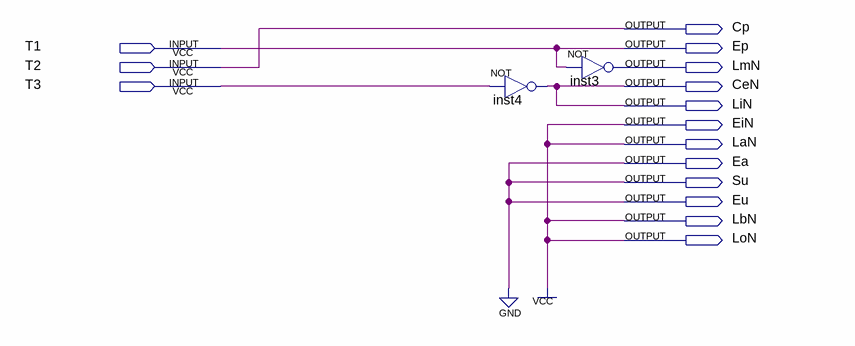
[diagram p0: schematic sheet]
// Quartus schematic Ciclo-Busca.bdf as structural Verilog: 2 symbols, 15 pins
module \Ciclo-Busca  (
  input  T1,
  input  T2,
  input  T3,
  output Cp,
  output Ep,
  output LmN,
  output CeN,
  output LiN,
  output EiN,
  output LaN,
  output Ea,
  output Su,
  output Eu,
  output LbN,
  output LoN
);

  not inst4 (CeN, T3);
  not inst3 (LmN, T1);

  assign Cp = T2;
  assign Ea = 1'b0;
  assign EiN = 1'b1;
  assign Ep = T1;
  assign Eu = 1'b0;
  assign LaN = 1'b1;
  assign LbN = 1'b1;
  assign LiN = CeN;
  assign LoN = 1'b1;
  assign Su = 1'b0;
endmodule
